# Altium project UltraZOhm_CarrierBoard.PrjPcb (part 5 of 8)

## Sheet J2.SchDoc
size A4; PageSetup: Record=PageOptions|CenterHorizontal=True|CenterVertical=True|PrintScale=1.00|XCorrection=1.00|YCorrection=1.00|PrintKind=0|BorderSize=5000000|LeftOffset=0|BottomOffset=0|Orientation=2|PaperLength=1000|PaperWidth=1000|Scale=100|PaperSource=7|PrintQuality=-3|MediaType=1|DitherType=10|PrintScaleMode=1|PaperKind=A4|PaperIndex=9; Author: A. Geiger & E. Liegmann; CompanyName: Technische Hochschule Nürnberg Georg Simon Ohm; Organization: UltraZohm; Address1: Kesslerplatz 12; Address2: 90489 Nürnberg; Address3: GERMANY; SheetNumber: 4; SheetTotal: 36; Website: www.ultrazohm.com
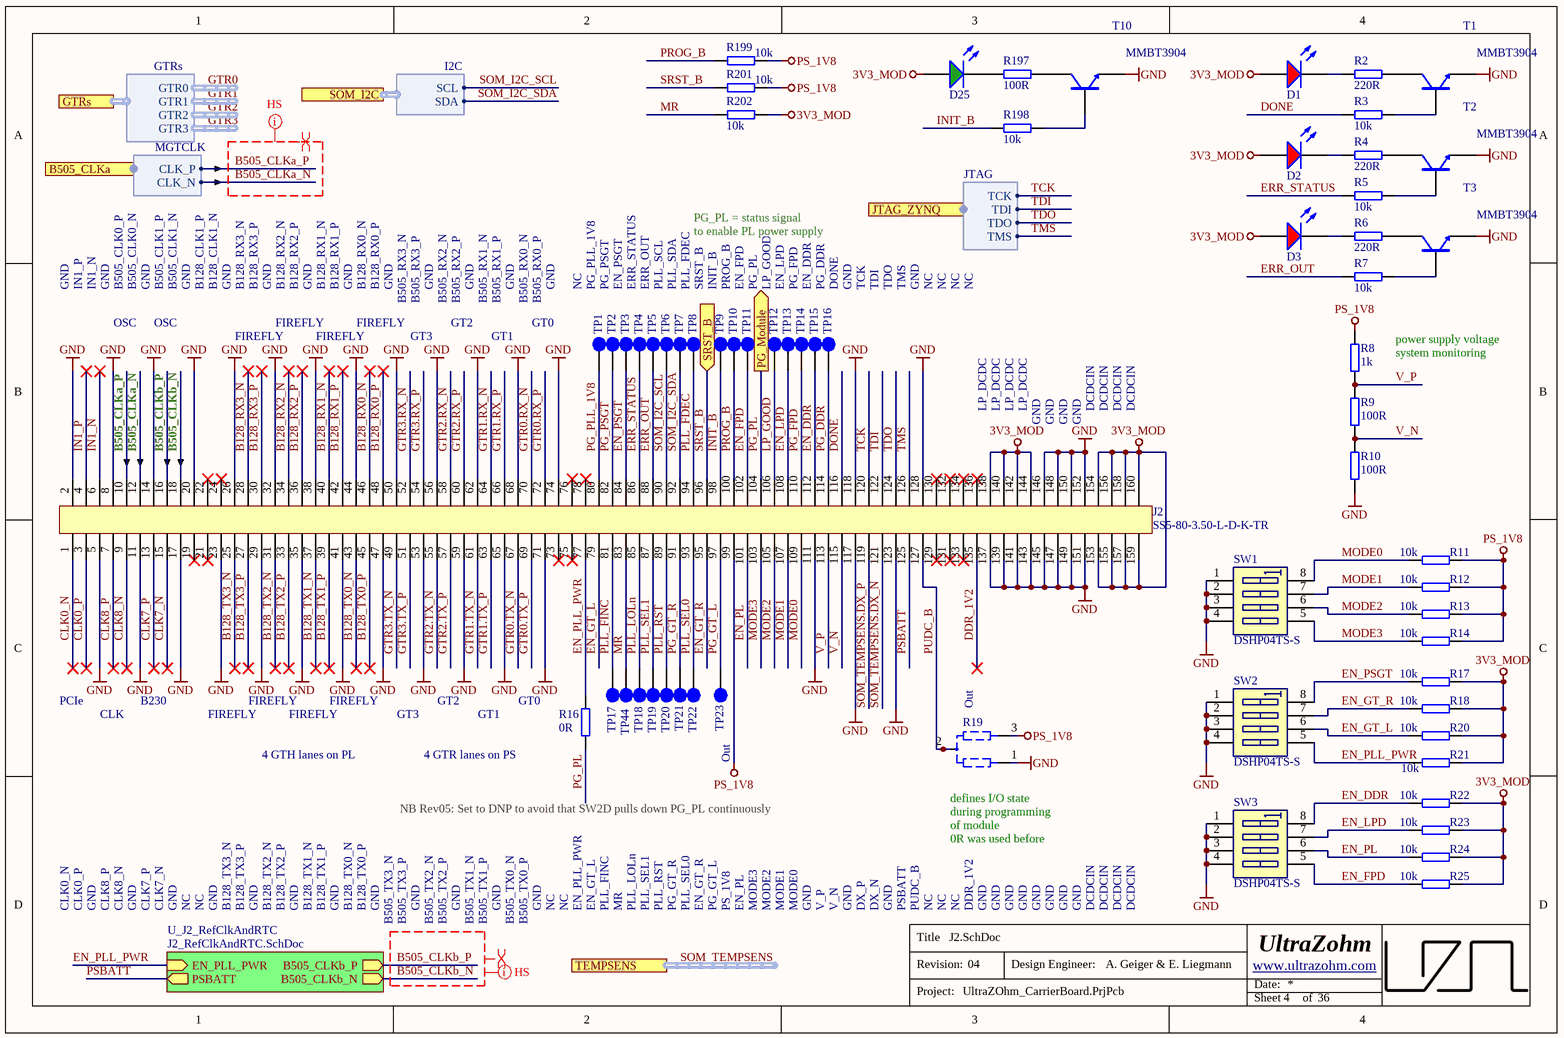
[diagram p13: J2.SchDoc]

### Parts
D1  LED Red  [WL-SMCW_0603]  (value not drawn)
D2  LED Red  [WL-SMCW_0603]  (value not drawn)
D3  LED Red  [WL-SMCW_0603]  (value not drawn)
D25  LED Green  [WL-SMCW_0603]  (value not drawn)
J2  SS5-80-3.50-L-D-K-TR  [SS5-80-3.50-L-D-K-TR]
R2  220R  [R_0603_TE]
R3  10k  [R_0603_TE]
R4  220R  [R_0603_TE]
R5  10k  [R_0603_TE]
R6  220R  [R_0603_TE]
R7  10k  [R_0603_TE]
R8  1k  [R_0603_TE]
R9  100R  [R_0603_TE]
R10  100R  [R_0603_TE]
R11  10k  [R_0603_TE]
R12  10k  [R_0603_TE]
R13  10k  [R_0603_TE]
R14  10k  [R_0603_TE]
R16  0R  [R_0603_TE]
R17  10k  [R_0603_TE]
R18  10k  [R_0603_TE]
R19  Manual Assembly 1608 (0603)  [TP_DUAL_RES_0603]  (value not drawn)  (no BOM)
R20  10k  [R_0603_TE]
R21  10k  [R_0603_TE]
R22  10k  [R_0603_TE]
R23  10k  [R_0603_TE]
R24  10k  [R_0603_TE]
R25  10k  [R_0603_TE]
R197  100R  [R_0603_TE]
R198  10k  [R_0603_TE]
R199  10k  [R_0603_TE]
R201  10k  [R_0603_TE]
R202  10k  [R_0603_TE]
SW1  DSHP04TS-S  [416131160804]
SW2  DSHP04TS-S  [416131160804]
SW3  DSHP04TS-S  [416131160804]
T1  MMBT3904  [SOT95P280X145-3N]
T2  MMBT3904  [SOT95P280X145-3N]
T3  MMBT3904  [SOT95P280X145-3N]
T10  MMBT3904  [SOT95P280X145-3N]
TP1  Testpoint 1mm  [TP_1mm]  (value not drawn)  (no BOM)
TP2  Testpoint 1mm  [TP_1mm]  (value not drawn)  (no BOM)
TP3  Testpoint 1mm  [TP_1mm]  (value not drawn)  (no BOM)
TP4  Testpoint 1mm  [TP_1mm]  (value not drawn)  (no BOM)
TP5  Testpoint 1mm  [TP_1mm]  (value not drawn)  (no BOM)
TP6  Testpoint 1mm  [TP_1mm]  (value not drawn)  (no BOM)
TP7  Testpoint 1mm  [TP_1mm]  (value not drawn)  (no BOM)
TP8  Testpoint 1mm  [TP_1mm]  (value not drawn)  (no BOM)
TP9  Testpoint 1mm  [TP_1mm]  (value not drawn)  (no BOM)
TP10  Testpoint 1mm  [TP_1mm]  (value not drawn)  (no BOM)
TP11  Testpoint 1mm  [TP_1mm]  (value not drawn)  (no BOM)
TP12  Testpoint 1mm  [TP_1mm]  (value not drawn)  (no BOM)
TP13  Testpoint 1mm  [TP_1mm]  (value not drawn)  (no BOM)
TP14  Testpoint 1mm  [TP_1mm]  (value not drawn)  (no BOM)
TP15  Testpoint 1mm  [TP_1mm]  (value not drawn)  (no BOM)
TP16  Testpoint 1mm  [TP_1mm]  (value not drawn)  (no BOM)
TP17  Testpoint 1mm  [TP_1mm]  (value not drawn)  (no BOM)
TP18  Testpoint 1mm  [TP_1mm]  (value not drawn)  (no BOM)
TP19  Testpoint 1mm  [TP_1mm]  (value not drawn)  (no BOM)
TP20  Testpoint 1mm  [TP_1mm]  (value not drawn)  (no BOM)
TP21  Testpoint 1mm  [TP_1mm]  (value not drawn)  (no BOM)
TP22  Testpoint 1mm  [TP_1mm]  (value not drawn)  (no BOM)
TP23  Testpoint 1mm  [TP_1mm]  (value not drawn)  (no BOM)
TP44  Testpoint 1mm  [TP_1mm]  (value not drawn)  (no BOM)

### Sub-sheets
U_J2_RefClkAndRTC = J2_RefClkAndRTC.SchDoc (file not in this document): EN_PLL_PWR (in), B505_CLKb_P (out), B505_CLKb_N (out), PSBATT (out)

### Ports
B505_CLKa (harness MGTCLK), GTRs (harness GTRs), JTAG_ZYNQ (harness JTAG), PG_Module (out), SOM_I2C (harness I2C), SRST_B (in), TEMPSENS (harness T_DIODE)

### Harnesses
JTAG: TDI, TCK, TMS, TDO
I2C: SCL, SDA
GTRs: GTR0, GTR1, GTR2, GTR3
MGTCLK: CLK_N, CLK_P

### Nets
3V3_MOD: D1.2(A) D2.2(A) D3.2(A) D25.2(A) J2.138 J2.140 J2.142 J2.144 J2.153 J2.154 J2.155 J2.156 J2.157 J2.158 J2.159 J2.160 R17.2 R18.2 R20.2 R21.2 R22.2 R23.2 R24.2 R25.2 R202.2
GND: J2.2 J2.5 J2.8 J2.11 J2.14 J2.17 J2.20 J2.23 J2.26 J2.29 J2.32 J2.35 J2.38 J2.41 J2.44 J2.47 J2.50 J2.53 J2.56 J2.59 J2.62 J2.65 J2.68 J2.71 J2.74 J2.111 J2.117 J2.118 J2.123 J2.128 J2.137 J2.139 J2.141 J2.143 J2.145 J2.146 J2.147 J2.148 J2.149 J2.150 J2.151 J2.152 R10.1 R19.1 SW1.1 SW1.2 SW1.3 SW1.4 SW2.1 SW2.2 SW2.3 SW2.4 SW3.1 SW3.2 SW3.3 SW3.4 T1.2(EMITTER) T2.2(EMITTER) T3.2(EMITTER) T10.2(EMITTER)
PS_1V8: J2.99 R8.2 R11.2 R12.2 R13.2 R14.2 R19.3 R199.2 R201.2
B128_RX0_N: J2.46
B128_RX0_P: J2.48
B128_RX1_N: J2.40
B128_RX1_P: J2.42
B128_RX2_N: J2.34
B128_RX2_P: J2.36
B128_RX3_N: J2.28
B128_RX3_P: J2.30
B128_TX0_N: J2.43
B128_TX0_P: J2.45
B128_TX1_N: J2.37
B128_TX1_P: J2.39
B128_TX2_N: J2.31
B128_TX2_P: J2.33
B128_TX3_N: J2.25
B128_TX3_P: J2.27
B505_CLKa_N: J2.12 ; port B505_CLKa.CLK_N
B505_CLKa_P: J2.10 ; port B505_CLKa.CLK_P
B505_CLKb_N: J2.18 ; sheet U_J2_RefClkAndRTC/B505_CLKb_N
B505_CLKb_P: J2.16 ; sheet U_J2_RefClkAndRTC/B505_CLKb_P
CLK0_N: J2.1
CLK0_P: J2.3
CLK7_N: J2.15
CLK7_P: J2.13
CLK8_N: J2.9
CLK8_P: J2.7
DDR_1V2: J2.135
DONE: J2.116 R3.1
EN_DDR: J2.112 R22.1 SW3.8 TP15.1
EN_FPD: J2.102 R25.1 SW3.5 TP11.1
EN_GT_L: J2.79 R20.1 SW2.6
EN_GT_R: J2.95 R18.1 SW2.7
EN_LPD: J2.108 R23.1 SW3.7 TP13.1
EN_PL: J2.101 R24.1 SW3.6
EN_PLL_PWR: J2.77 R16.2 R21.1 SW2.5 ; sheet U_J2_RefClkAndRTC/EN_PLL_PWR
EN_PSGT: J2.84 R17.1 SW2.8 TP3.1
ERR_OUT: J2.88 R7.1 TP5.1
ERR_STATUS: J2.86 R5.1 TP4.1
GTR0.RX_N: J2.70
GTR0.RX_P: J2.72
GTR0.TX_N: J2.67
GTR0.TX_P: J2.69
GTR1.RX_N: J2.64
GTR1.RX_P: J2.66
GTR1.TX_N: J2.61
GTR1.TX_P: J2.63
GTR2.RX_N: J2.58
GTR2.RX_P: J2.60
GTR2.TX_N: J2.55
GTR2.TX_P: J2.57
GTR3.RX_N: J2.52
GTR3.RX_P: J2.54
GTR3.TX_N: J2.49
GTR3.TX_P: J2.51
IN1_N: J2.6
IN1_P: J2.4
INIT_B: J2.98 R198.1 TP9.1
LP_GOOD: J2.106 TP12.1
MODE0: J2.109 R11.1 SW1.8
MODE1: J2.107 R12.1 SW1.7
MODE2: J2.105 R13.1 SW1.6
MODE3: J2.103 R14.1 SW1.5
MR: J2.83 R202.1 TP44.1
PG_DDR: J2.114 TP16.1
PG_FPD: J2.110 TP14.1
PG_GT_L: J2.97 TP23.1
PG_GT_R: J2.91 TP21.1
PG_PL: J2.104 R16.1 ; port PG_Module
PG_PLL_1V8: J2.80 TP1.1
PG_PSGT: J2.82 TP2.1
PLL_FDEC: J2.94 TP8.1
PLL_FINC: J2.81 TP17.1
PLL_LOLn: J2.85 TP18.1
PLL_RST: J2.89 TP20.1
PLL_SEL0: J2.93 TP22.1
PLL_SEL1: J2.87 TP19.1
PROG_B: J2.100 R199.1 TP10.1
PSBATT: J2.125 ; sheet U_J2_RefClkAndRTC/PSBATT
PUDC_B: J2.127 R19.2
SOM_I2C_SCL: J2.90 TP6.1 ; port SOM_I2C.SCL
SOM_I2C_SDA: J2.92 TP7.1 ; port SOM_I2C.SDA
SOM_TEMPSENS.DX_N: J2.121
SOM_TEMPSENS.DX_P: J2.119
SRST_B: J2.96 R201.1 ; port SRST_B
TCK: J2.120 ; port JTAG_ZYNQ.TCK
TDI: J2.122 ; port JTAG_ZYNQ.TDI
TDO: J2.124 ; port JTAG_ZYNQ.TDO
TMS: J2.126 ; port JTAG_ZYNQ.TMS
V_N: J2.115 R9.1 R10.2
V_P: J2.113 R8.1 R9.2
NetD1_1: D1.1(K) R2.1
NetD2_1: D2.1(K) R4.1
NetD3_1: D3.1(K) R6.1
NetD25_1: D25.1(K) R197.2
NetR2_2: R2.2 T1.3(COLLECTOR)
NetR3_2: R3.2 T1.1(BASIS)
NetR4_2: R4.2 T2.3(COLLECTOR)
NetR5_2: R5.2 T2.1(BASIS)
NetR6_2: R6.2 T3.3(COLLECTOR)
NetR7_2: R7.2 T3.1(BASIS)
NetR197_1: R197.1 T10.3(COLLECTOR)
NetR198_2: R198.2 T10.1(BASIS)

Not connected (* = marked no-connect by the designer): J2 19* 21* 22* 24* 73* 75* 76* 78* 129* 130* 131* 132* 133* 134* 136*

### Buses and harness runs
harness SOM_TEMPSENS = port TEMPSENS

### Layout directives
differential pair: B505_CLKa_N, B505_CLKa_P, B505_CLKb_N, B505_CLKb_P
net class HS: B505_CLKa_N, B505_CLKa_P, B505_CLKb_N, B505_CLKb_P

### Notes on the sheet
- PG_PL = status signal
  to enable PL power supply
- GND
- IN1_P
- IN1_N
- B505_CLK0_P
- B505_CLK0_N
- B505_CLK1_P
- B505_CLK1_N
- B128_CLK1_P
- B128_CLK1_N
- B128_RX3_N
- B128_RX3_P
- B128_RX2_N
- B128_RX2_P
- B128_RX1_N
- B128_RX1_P
- B128_RX0_N
- B128_RX0_P
- B505_RX3_N
- B505_RX3_P
- B505_RX2_N
- B505_RX2_P
- B505_RX1_N
- B505_RX1_P
- B505_RX0_N
- B505_RX0_P
- NC
- PG_PLL_1V8
- PG_PSGT
- EN_PSGT
- ERR_STATUS
- ERR_OUT
- PLL_SCL
- PLL_SDA
- PLL_FDEC
- SRST_B
- INIT_B
- PROG_B
- EN_FPD
- PG_PL
- LP_GOOD
- EN_LPD
- PG_FPD
- EN_DDR
- PG_DDR
- DONE
- TCK
- TDI
- TDO
- TMS
- OSC
- FIREFLY
- GT3
- GT2
- GT1
- GT0
- power supply voltage system monitoring
- LP_DCDC
- DCDCIN
- PCIe
- CLK
- B230
- (near R19) Out
- 4 GTH lanes on PL
- 4 GTR lanes on PS
- Out
- NB Rev05: Set to DNP to avoid that SW2D pulls down PG_PL continuously
- (near R19) defines I/O state during programming of module
  0R was used before
- CLK0_N
- CLK0_P
- CLK8_P
- CLK8_N
- CLK7_P
- CLK7_N
- B128_TX3_N
- B128_TX3_P
- B128_TX2_N
- B128_TX2_P
- B128_TX1_N
- B128_TX1_P
- B128_TX0_N
- B128_TX0_P
- B505_TX3_N
- B505_TX3_P
- B505_TX2_N
- B505_TX2_P
- B505_TX1_N
- B505_TX1_P
- B505_TX0_N
- B505_TX0_P
- EN_PLL_PWR
- EN_GT_L
- PLL_FINC
- MR
- PLL_LOLn
- PLL_SEL1
- PLL_RST
- PG_GT_R
- PLL_SEL0
- EN_GT_R
- PG_GT_L
- PS_1V8
- EN_PL
- MODE3
- MODE2
- MODE1
- MODE0
- V_P
- V_N
- DX_P
- DX_N
- PSBATT
- PUDC_B
- DDR_1V2
- Title
- Revision:
- Design Engineer:
- Date:
- Project:
- Sheet
- of

### Library data of the parts
D1-D3 = UZgen_LED_0603_Red: Standard LEDs - SMD 0603 red; Manufacturer: UZgen; Created from: UZgenTool; Manufacturer Part Number: UZgen_LED_0603_Red; PartID: 22; Created On: 09/09/2024 10:45:01; ComponentLink1Description: N/A; ComponentLink1URL: N/A; Component Type: LED Diode; Device Package: 0603; Last Updated: 09/09/2024 10:45:01; Mounting Type: SMD; Supplier 1: LCSC; Supplier Part Number 1: =LCSC Part Number; Type: Standard; Value: LED Red; Live Cycle Status: 1; Stock number: not stored; Color: red
D25 = UZgen_LED_0603_Green: Standard LEDs - SMD 0603 green; Manufacturer: UZgen; Created from: UZgenTool; Manufacturer Part Number: UZgen_LED_0603_Green; PartID: 21; Created On: 09/09/2024 10:45:01; ComponentLink1Description: N/A; ComponentLink1URL: N/A; Component Type: LED Diode; Device Package: 0603; Last Updated: 09/09/2024 10:45:01; Mounting Type: SMD; Supplier 1: LCSC; Supplier Part Number 1: =LCSC Part Number; Type: Standard; Value: LED Green; Live Cycle Status: 1; Stock number: not stored; Color: green
J2 = SS5-80-3.50-L-D-K-TR: 0.5 mm Ultra Fine Pitch Socket REF192552-01, 160 Pins; Manufacturer: SAMTEC; Created from: MGremer; Number of positions: 80; Manufacturer Part Number: SS5-80-3.50-L-D-K-TR; PartID: 27; Created On: 01/12/2020 18:14:32; ComponentLink1Description: Homepage; ComponentLink1URL: https://www.samtec.com/de/products/ss5-80-3.50-l-d-k-tr; Component Type: Samtec Connector; Device Package: Connector; Last Updated: 11/07/2024 09:43:54; Mounting Type: SMD; Supplier 1: SAMTEC; Supplier Part Number 1: SS5-80-3.50-L-D-K-TR; Type: Connector; Live Cycle Status: 1; Number of rows: 2; LCSC Part Number: C5292077; Stock number: not stored
R2 R4 R6 = UZgen_R_0603_220R: Generic resistor; Manufacturer: UZgen; Tolerance: 1 %; Created from: UZgenTool; Value: 220R; Manufacturer Part Number: UZgen_R_0603_220R; PartID: 205; Created On: 02/07/2024 17:29:49; Device Package: 0603; Mounting Type: SMD; Last Updated: 02/07/2024 17:29:49
R3 R5 R7 R11-R14 R17 R18 R20-R25 R198 R199 R201 R202 = UZgen_R_0603_10k: Generic resistor; Manufacturer: UZgen; Tolerance: 1 %; Created from: AGeiger; Value: 10k; Manufacturer Part Number: UZgen_R_0603_10k; PartID: 1; Created On: 02/07/2024 14:34:53; Device Package: 0603; Mounting Type: SMD; Last Updated: 02/07/2024 14:37:16
R8 = UZgen_R_0603_1k: Generic resistor; Manufacturer: UZgen; Tolerance: 1 %; Created from: UZgenTool; Value: 1k; Manufacturer Part Number: UZgen_R_0603_1k; PartID: 221; Created On: 02/07/2024 17:29:49; Device Package: 0603; Mounting Type: SMD; Last Updated: 02/07/2024 17:29:49
R9 R10 R197 = UZgen_R_0603_100R: Generic resistor; Manufacturer: UZgen; Tolerance: 1 %; Created from: UZgenTool; Value: 100R; Manufacturer Part Number: UZgen_R_0603_100R; PartID: 197; Created On: 02/07/2024 17:29:48; Device Package: 0603; Mounting Type: SMD; Last Updated: 02/07/2024 17:29:48
R16 = UZgen_R_0603_0R: Generic resistor; Manufacturer: UZgen; Tolerance: 1 %; Created from: UZgenTool; Value: 0R; Manufacturer Part Number: UZgen_R_0603_0R; PartID: 581; Created On: 08/07/2024 14:34:30; Device Package: 0603; Mounting Type: SMD; Last Updated: 08/07/2024 14:34:30
R19 = 30792: Manual Assembly Resistors Placeholder 1608 (0603) Dual; AN: 30792; Mixed: MECH
SW1-SW3 = DSHP04TS-S: 04p, 1.27mm Pitch, Horizontal, HP Type, SMT, flat Actuator, black, with Tape, T&R; Manufacturer: XKB Connectivity; Value: DIP-Switch; Created from: T. Wendt; Manufacturer Part Number: DSHP04TS-S; PartID: 6; Created On: 02/03/2021 14:59:37; ComponentLink1Description: Datasheet; ComponentLink1URL: https://datasheet.lcsc.com/szlcsc/1912111437_XKB-Connectivity-DSHP04TS-S_C319050.pdf; Component Type: DIP-Switch; Device Package: DIP; Last Updated: 08/10/2021 08:00:32; Minimum Order: 1; Mounting Type: SMD; Supplier 1: LCSC; Supplier Part Number 1: C319050; Type: DIP-Switch; Live Cycle Status: 1; LCSC Part Number: C319050; Stock number: not stored
T1-T3 T10 = MMBT3904: Bipolartransistor, 40V 200mW 200mA 100@10mA,1V 300MHz 300mV@50mA,5mA NPN +150℃@(Tj) SOT-23(SOT-23-3); Manufacturer: Jiangsu Changjing Electronics Technology Co., Ltd.; Number Of Channels: single; Collector Basis Voltage: 60 V; Created from: NDiringer; Manufacturer Part Number: MMBT3904; PartID: 2; Created On: 10/06/2022 12:04:49; ComponentLink1Description: Datasheet; ComponentLink1URL: https://datasheet.lcsc.com/lcsc/1811011934_Jiangsu-Changjing-Electronics-Technology-Co---Ltd--MMBT3904_C20526.pdf; Component Type: Bipolartransistor; Device Package: SOT-23-3; Last Updated: 10/08/2022 13:48:16; Mounting Type: SMD; Operating Temperature: -55 - 150 °C; Series: MMBT3904; Supplier 1: Mouser; Supplier Part Number 1: MMBT3904; Supplier 2: LCSC/JLCPCB; Supplier Part Number 2: C20526; Type: Bipolartransistor; Collector Emitter Voltage: 40 V; Polarization: NPN; Power Dissipation: 200 mW; Value: 40 V; Live Cycle Status: 1; LCSC Part Number: C20526
TP1-TP23 TP44 = 25063: AN: 25063; Mixed: SMT

## Sheet J3.SchDoc
size A4; Author: A. Geiger & E. Liegmann; CompanyName: Technische Hochschule Nürnberg Georg Simon Ohm; Organization: UltraZohm; Address1: Kesslerplatz 12; Address2: 90489 Nürnberg; Address3: GERMANY; SheetNumber: 5; SheetTotal: 36; Website: www.ultrazohm.com
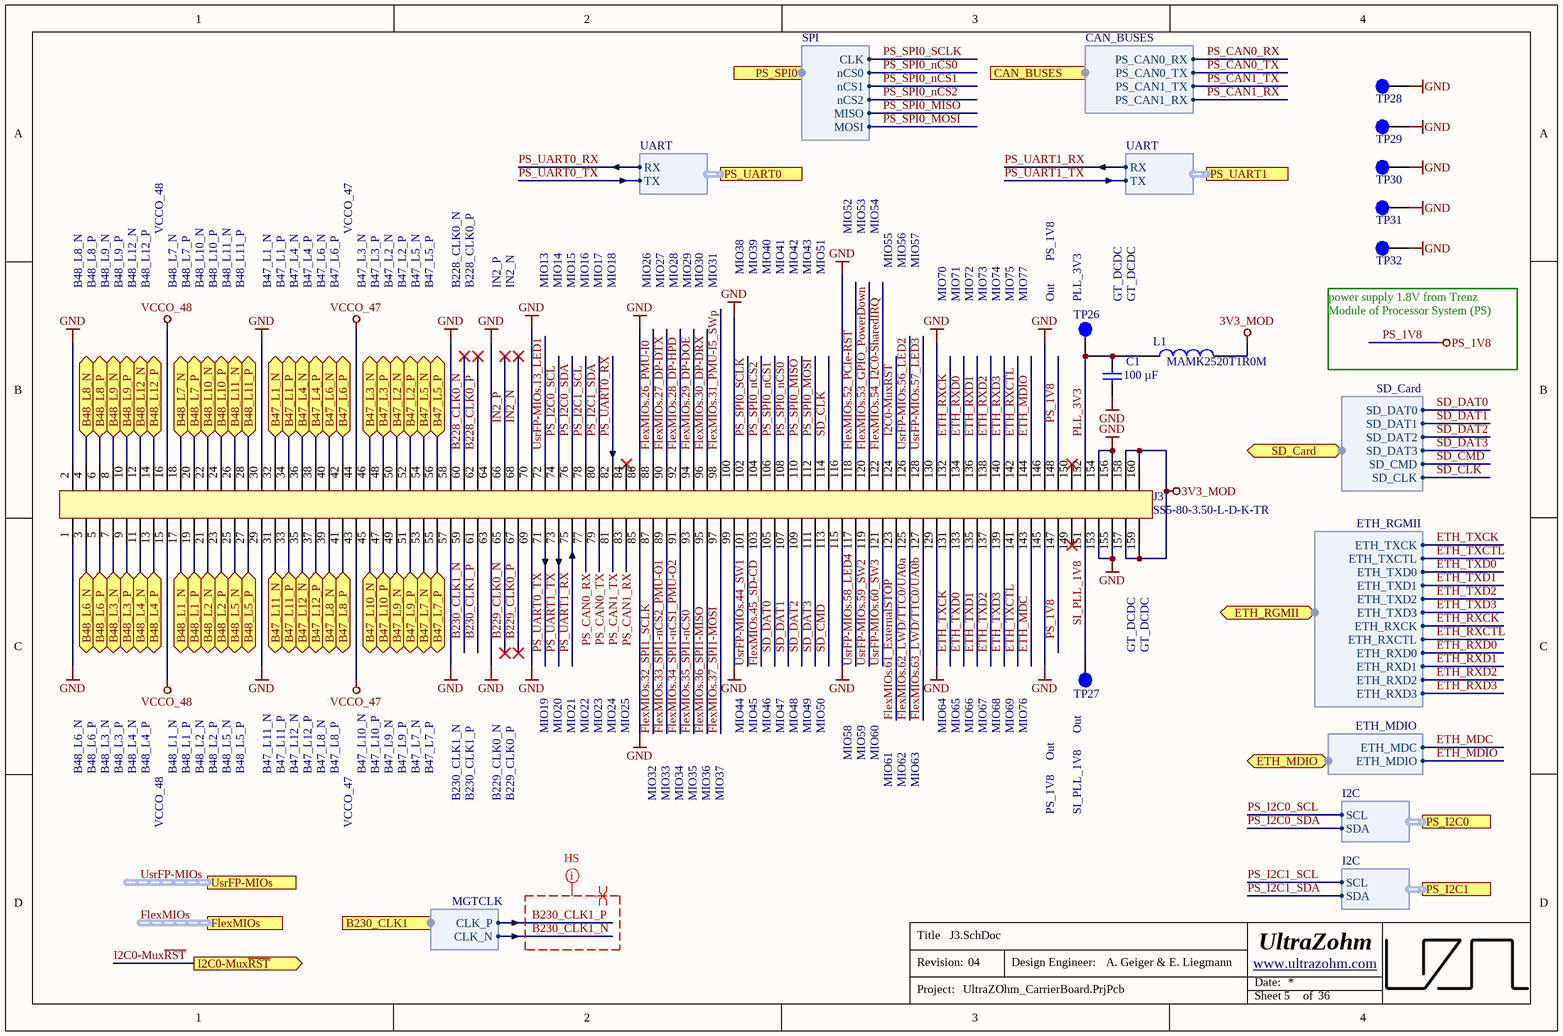
[diagram p14: J3.SchDoc]

### Parts
C1  100 µF  [C_1206_TE]
J3  SS5-80-3.50-L-D-K-TR  [SS5-80-3.50-L-D-K-TR]
L1  MAMK2520T1R0M  [INDC2520X120N]
TP26  Testpoint 1mm  [TP_1mm]  (value not drawn)  (no BOM)
TP27  Testpoint 1mm  [TP_1mm]  (value not drawn)  (no BOM)
TP28  Testpoint 1mm  [TP_1mm]  (value not drawn)  (no BOM)
TP29  Testpoint 1mm  [TP_1mm]  (value not drawn)  (no BOM)
TP30  Testpoint 1mm  [TP_1mm]  (value not drawn)  (no BOM)
TP31  Testpoint 1mm  [TP_1mm]  (value not drawn)  (no BOM)
TP32  Testpoint 1mm  [TP_1mm]  (value not drawn)  (no BOM)

### Ports
B47_L1_N (bidir), B47_L1_P (bidir), B47_L2_N (bidir), B47_L2_P (bidir), B47_L3_N (bidir), B47_L3_P (bidir), B47_L4_N (bidir), B47_L4_P (bidir), B47_L5_N (bidir), B47_L5_P (bidir), B47_L6_N (bidir), B47_L6_P (bidir), B47_L7_N (bidir), B47_L7_P (bidir), B47_L8_N (bidir), B47_L8_P (bidir), B47_L9_N (bidir), B47_L9_P (bidir), B47_L10_N (bidir), B47_L10_P (bidir), B47_L11_N (bidir), B47_L11_P (bidir), B47_L12_N (bidir), B47_L12_P (bidir), B48_L1_N (bidir), B48_L1_P (bidir), B48_L2_N (bidir), B48_L2_P (bidir), B48_L3_N (bidir), B48_L3_P (bidir), B48_L4_N (bidir), B48_L4_P (bidir), B48_L5_N (bidir), B48_L5_P (bidir), B48_L6_N (bidir), B48_L6_P (bidir), B48_L7_N (bidir), B48_L7_P (bidir), B48_L8_N (bidir), B48_L8_P (bidir), B48_L9_N (bidir), B48_L9_P (bidir), B48_L10_N (bidir), B48_L10_P (bidir), B48_L11_N (bidir), B48_L11_P (bidir), B48_L12_N (bidir), B48_L12_P (bidir), B230_CLK1 (harness MGTCLK), CAN_BUSES (harness CAN_BUSES), ETH_MDIO (bidir, harness ETH_MDIO), ETH_RGMII (bidir, harness ETH_RGMII), FlexMIOs (harness FlexMIOs), I2C0-Mux~{RST} (out), PS_I2C0 (harness I2C), PS_I2C1 (harness I2C), PS_SPI0 (harness SPI), PS_UART0 (harness UART), PS_UART1 (harness UART), SD_Card (bidir, harness SD_Card), UsrFP-MIOs (harness UsrFP-MIOs)

### Harnesses
ETH_RGMII: ETH_TXCK, ETH_TXCTL, ETH_TXD0, ETH_TXD1, ETH_TXD2, ETH_TXD3, ETH_RXCK, ETH_RXCTL, ETH_RXD0, ETH_RXD1, ETH_RXD2, ETH_RXD3
SD_Card: SD_DAT0, SD_DAT1, SD_DAT2, SD_DAT3, SD_CMD, SD_CLK
ETH_MDIO: ETH_MDC, ETH_MDIO
SPI: CLK, nCS0, MISO, MOSI, nCS1, nCS2
CAN_BUSES: PS_CAN0_RX, PS_CAN1_RX, PS_CAN1_TX, PS_CAN0_TX
I2C: SCL, SDA
UART: RX, TX
MGTCLK: CLK_N, CLK_P

### Nets
3V3_MOD: J3.157 J3.158 J3.159 J3.160 L1.2
GND: C1.2 J3.1 J3.2 J3.29 J3.30 J3.57 J3.58 J3.63 J3.64 J3.69 J3.70 J3.85 J3.86 J3.99 J3.100 J3.115 J3.116 J3.129 J3.130 J3.145 J3.146 J3.153 J3.154 J3.155 J3.156 TP28.1 TP29.1 TP30.1 TP31.1 TP32.1
PS_1V8: J3.147 J3.148
VCCO_47: J3.43 J3.44
VCCO_48: J3.15 J3.16
B228_CLK0_N: J3.60
B228_CLK0_P: J3.62
B229_CLK0_N: J3.65
B229_CLK0_P: J3.67
B230_CLK1_N: J3.59 ; port B230_CLK1.CLK_N
B230_CLK1_P: J3.61 ; port B230_CLK1.CLK_P
DIG_00_Ch4: J3.32 ; port B47_L1_N
DIG_01_Ch4: J3.31 ; port B47_L11_N
DIG_02_Ch4: J3.28 ; port B48_L11_P
DIG_03_Ch4: J3.27 ; port B48_L5_P
DIG_04_Ch4: J3.26 ; port B48_L11_N
DIG_05_Ch4: J3.25 ; port B48_L5_N
DIG_06_Ch4: J3.24 ; port B48_L10_P
DIG_07_Ch4: J3.23 ; port B48_L2_P
DIG_08_Ch4: J3.22 ; port B48_L10_N
DIG_08_Ch5: J3.56 ; port B47_L5_P
DIG_09_Ch4: J3.21 ; port B48_L2_N
DIG_09_Ch5: J3.55 ; port B47_L7_P
DIG_10_Ch4: J3.20 ; port B48_L7_P
DIG_10_Ch5: J3.54 ; port B47_L5_N
DIG_11_Ch4: J3.19 ; port B48_L1_P
DIG_11_Ch5: J3.53 ; port B47_L7_N
DIG_12_Ch4: J3.18 ; port B48_L7_N
DIG_12_Ch5: J3.52 ; port B47_L2_P
DIG_13_Ch4: J3.17 ; port B48_L1_N
DIG_13_Ch5: J3.51 ; port B47_L9_P
DIG_14_Ch4: J3.14 ; port B48_L12_P
DIG_14_Ch5: J3.50 ; port B47_L2_N
DIG_15_Ch4: J3.13 ; port B48_L4_P
DIG_15_Ch5: J3.49 ; port B47_L9_N
DIG_16_Ch4: J3.12 ; port B48_L12_N
DIG_16_Ch5: J3.48 ; port B47_L3_P
DIG_17_Ch4: J3.11 ; port B48_L4_N
DIG_17_Ch5: J3.47 ; port B47_L10_P
DIG_18_Ch4: J3.10 ; port B48_L9_P
DIG_18_Ch5: J3.46 ; port B47_L3_N
DIG_19_Ch4: J3.9 ; port B48_L3_P
DIG_19_Ch5: J3.45 ; port B47_L10_N
DIG_20_Ch4: J3.8 ; port B48_L9_N
DIG_20_Ch5: J3.42 ; port B47_L6_P
DIG_21_Ch4: J3.7 ; port B48_L3_N
DIG_21_Ch5: J3.41 ; port B47_L8_P
DIG_22_Ch4: J3.6 ; port B48_L8_P
DIG_22_Ch5: J3.40 ; port B47_L6_N
DIG_23_Ch4: J3.5 ; port B48_L6_P
DIG_23_Ch5: J3.39 ; port B47_L8_N
DIG_24_Ch3: J3.4 ; port B48_L8_N
DIG_24_Ch4: J3.38 ; port B47_L4_P
DIG_25_Ch3: J3.3 ; port B48_L6_N
DIG_25_Ch4: J3.37 ; port B47_L12_P
DIG_26_Ch4: J3.36 ; port B47_L4_N
DIG_27_Ch4: J3.35 ; port B47_L12_N
DIG_28_Ch4: J3.34 ; port B47_L1_P
DIG_29_Ch4: J3.33 ; port B47_L11_P
ETH_MDC: J3.143 ; port ETH_MDIO.ETH_MDC
ETH_MDIO: J3.144 ; port ETH_MDIO.ETH_MDIO
ETH_RXCK: J3.132 ; port ETH_RGMII.ETH_RXCK
ETH_RXCTL: J3.142 ; port ETH_RGMII.ETH_RXCTL
ETH_RXD0: J3.134 ; port ETH_RGMII.ETH_RXD0
ETH_RXD1: J3.136 ; port ETH_RGMII.ETH_RXD1
ETH_RXD2: J3.138 ; port ETH_RGMII.ETH_RXD2
ETH_RXD3: J3.140 ; port ETH_RGMII.ETH_RXD3
ETH_TXCK: J3.131 ; port ETH_RGMII.ETH_TXCK
ETH_TXCTL: J3.141 ; port ETH_RGMII.ETH_TXCTL
ETH_TXD0: J3.133 ; port ETH_RGMII.ETH_TXD0
ETH_TXD1: J3.135 ; port ETH_RGMII.ETH_TXD1
ETH_TXD2: J3.137 ; port ETH_RGMII.ETH_TXD2
ETH_TXD3: J3.139 ; port ETH_RGMII.ETH_TXD3
FlexMIOs.26_PMU-I0: J3.88
FlexMIOs.27_DP-DTX: J3.90
FlexMIOs.28_DP-HPD: J3.92
FlexMIOs.29_DP-DOE: J3.94
FlexMIOs.30_DP-DRX: J3.96
FlexMIOs.31_PMU-I5_SWp: J3.98
FlexMIOs.32_SPI1_SCLK: J3.87
FlexMIOs.33_SPI1-nCS2_PMU-O1: J3.89
FlexMIOs.34_SPI1-nCS1_PMU-O2: J3.91
FlexMIOs.35_SPI1-nCS0: J3.93
FlexMIOs.36_SPI1-MISO: J3.95
FlexMIOs.37_SPI1-MOSI: J3.97
FlexMIOs.45_SD-CD: J3.103
FlexMIOs.52_PCIe-~{RST}: J3.118
FlexMIOs.53_GPIO_PowerDown: J3.120
FlexMIOs.54_I2C0-Shared~{IRQ}: J3.122
FlexMIOs.61_ExternalSTOP: J3.123
FlexMIOs.62_LWD/TTC0/UA0a: J3.125
FlexMIOs.63_LWD/TTC0/UA0b: J3.127
I2C0-Mux~{RST}: J3.124 ; port I2C0-Mux~{RST}
IN2_N: J3.68
IN2_P: J3.66
PLL_3V3: C1.1 J3.152 L1.1 TP26.1
PS_CAN0_RX: J3.77 ; port CAN_BUSES.PS_CAN0_RX
PS_CAN0_TX: J3.79 ; port CAN_BUSES.PS_CAN0_TX
PS_CAN1_RX: J3.83 ; port CAN_BUSES.PS_CAN1_RX
PS_CAN1_TX: J3.81 ; port CAN_BUSES.PS_CAN1_TX
PS_I2C0_SCL: J3.74 ; port PS_I2C0.SCL
PS_I2C0_SDA: J3.76 ; port PS_I2C0.SDA
PS_I2C1_SCL: J3.78 ; port PS_I2C1.SCL
PS_I2C1_SDA: J3.80 ; port PS_I2C1.SDA
PS_SPI0_MISO: J3.110 ; port PS_SPI0.MISO
PS_SPI0_MOSI: J3.112 ; port PS_SPI0.MOSI
PS_SPI0_nCS0: J3.108 ; port PS_SPI0.nCS0
PS_SPI0_nCS1: J3.106 ; port PS_SPI0.nCS1
PS_SPI0_nCS2: J3.104 ; port PS_SPI0.nCS2
PS_SPI0_SCLK: J3.102 ; port PS_SPI0.CLK
PS_UART0_RX: J3.82 ; port PS_UART0.RX
PS_UART0_TX: J3.71 ; port PS_UART0.TX
PS_UART1_RX: J3.75 ; port PS_UART1.RX
PS_UART1_TX: J3.73 ; port PS_UART1.TX
SD_CLK: J3.114 ; port SD_Card.SD_CLK
SD_CMD: J3.113 ; port SD_Card.SD_CMD
SD_DAT0: J3.105 ; port SD_Card.SD_DAT0
SD_DAT1: J3.107 ; port SD_Card.SD_DAT1
SD_DAT2: J3.109 ; port SD_Card.SD_DAT2
SD_DAT3: J3.111 ; port SD_Card.SD_DAT3
SI_PLL_1V8: J3.151 TP27.1
UsrFP-MIOs.13_LED1: J3.72
UsrFP-MIOs.44_SW1: J3.101
UsrFP-MIOs.56_LED2: J3.126
UsrFP-MIOs.57_LED3: J3.128
UsrFP-MIOs.58_LED4: J3.117
UsrFP-MIOs.59_SW2: J3.119
UsrFP-MIOs.60_SW3: J3.121

Not connected (* = marked no-connect by the designer): J3 84* 149* 150*

### Buses and harness runs
harness FlexMIOs = port FlexMIOs
harness UsrFP-MIOs = port UsrFP-MIOs

### Layout directives
differential pair: B230_CLK1_N, B230_CLK1_P
net class HS: B230_CLK1_N, B230_CLK1_P

### Notes on the sheet
- VCCO_48
- VCCO_47
- MIO52
- MIO53
- MIO54
- B48_L8_N
- B48_L8_P
- B48_L9_N
- B48_L9_P
- B48_L12_N
- B48_L12_P
- B48_L7_N
- B48_L7_P
- B48_L10_N
- B48_L10_P
- B48_L11_N
- B48_L11_P
- B47_L1_N
- B47_L1_P
- B47_L4_N
- B47_L4_P
- B47_L6_N
- B47_L6_P
- B47_L3_N
- B47_L3_P
- B47_L2_N
- B47_L2_P
- B47_L5_N
- B47_L5_P
- B228_CLK0_N
- B228_CLK0_P
- IN2_P
- IN2_N
- MIO13
- MIO14
- MIO15
- MIO16
- MIO17
- MIO18
- MIO26
- MIO27
- MIO28
- MIO29
- MIO30
- MIO31
- MIO38
- MIO39
- MIO40
- MIO41
- MIO42
- MIO43
- MIO51
- MIO55
- MIO56
- MIO57
- MIO70
- MIO71
- MIO72
- MIO73
- MIO74
- MIO75
- MIO77
- PS_1V8
- (near TP26) Out
- (near TP26) PLL_3V3
- (near TP26) GT_DCDC
- GT_DCDC
- (near TP32) power supply 1.8V from Trenz Module of Processor System (PS)
- (near TP27) GT_DCDC
- B48_L6_N
- B48_L6_P
- B48_L3_N
- B48_L3_P
- B48_L4_N
- B48_L4_P
- B48_L1_N
- B48_L1_P
- B48_L2_N
- B48_L2_P
- B48_L5_N
- B48_L5_P
- B47_L11_N
- B47_L11_P
- B47_L12_N
- B47_L12_P
- B47_L8_N
- B47_L8_P
- B47_L10_N
- B47_L10_P
- B47_L9_N
- B47_L9_P
- B47_L7_N
- B47_L7_P
- MIO19
- MIO20
- MIO21
- MIO22
- MIO23
- MIO24
- MIO25
- MIO44
- MIO45
- MIO46
- MIO47
- MIO48
- MIO49
- MIO50
- MIO58
- MIO59
- MIO60
- MIO61
- MIO62
- MIO63
- MIO64
- MIO65
- MIO66
- MIO67
- MIO68
- MIO69
- MIO76
- Out
- (near TP27) Out
- B230_CLK1_N
- B230_CLK1_P
- B229_CLK0_N
- B229_CLK0_P
- MIO32
- MIO33
- MIO34
- MIO35
- MIO36
- MIO37
- SI_PLL_1V8
- Title
- Revision:
- Design Engineer:
- Date:
- Project:
- Sheet
- of

### Library data of the parts
C1 = CL31A107MQHNNNE: 6.3V 100uF X5R ±20% 1206 Multilayer Ceramic Capacitors MLCC; Manufacturer: Samsung Electro-Mechanics; Created from: MGeier; Tolerance: 20%; Value: 100 µF; Manufacturer Part Number: CL31A107MQHNNNE; PartID: 152; Created On: 02/08/2024 16:00:00; ComponentLink1Description: Datasheet; ComponentLink1URL: https://wmsc.lcsc.com/wmsc/upload/file/pdf/v2/lcsc/2304140030_Samsung-Electro-Mechanics-CL31A107MQHNNNE_C15008.pdf; Component Type: Capacitor 1206; Device Package: 1206; Last Updated: 02/08/2024 16:00:00; Mounting Type: SMD; Operating Temperature: -55 - 85°C; Series: CL; Supplier 1: LCSC; Supplier Part Number 1: C15008; Type: Capacitor; Voltage Rating: 6.3 V; Live Cycle Status: 1; LCSC Part Number: C15008; Stock number: not stored
J3 = SS5-80-3.50-L-D-K-TR: as J2 on sheet J2; Manufacturer Part Number: SS5-80-3.50-L-D-K-TR; PartID: 27; Created On: 01/12/2020 18:14:32; ComponentLink1Description: Homepage; ComponentLink1URL: https://www.samtec.com/de/products/ss5-80-3.50-l-d-k-tr; Component Type: Samtec Connector; Device Package: Connector; Last Updated: 11/07/2024 09:43:54; Mounting Type: SMD; Supplier 1: SAMTEC; Supplier Part Number 1: SS5-80-3.50-L-D-K-TR; Type: Connector; Live Cycle Status: 1; Number of rows: 2; LCSC Part Number: C5292077; Stock number: not stored
L1 = MAMK2520T1R0M: 1uH @2MHz ±20%, 2.7A, 59mOhm, 5040; Manufacturer: Taiyo Yuden; MF: EPCOS / TDK; DCR: 320m; Rated Current: 0.85 A; Type: Inductance SMD; Created from: FRosner; Value: 1uH; MPN: B82464G4154M; Supplier 1: Mouser; Supplier Part Number 1: 963-MAMK2520T1R0M; Manufacturer Part Number: MAMK2520T1R0M; PartID: 23; Created On: 05/09/2024 10:52:30; ComponentLink1Description: Datasheet; ComponentLink1URL: https://www.mouser.de/datasheet/2/396/wound10_e-1396630.pdf; Component Type: SMD Power Inductor; Device Package: 1008 (2520 metric); Last Updated: 05/09/2024 12:46:26; Mounting Type: SMD; Operating Temperature: -40°C to +105°C; Series: MA; Supplier 2: LCSC; Supplier Part Number 2: C92924; DC current: 2.7 A; Live Cycle Status: 1; LCSC Part Number: C92924; Stock number: not stored
TP26-TP32 = 25063: AN: 25063; Mixed: SMT

## Sheet J4.SchDoc
size A4; Author: A. Geiger & E. Liegmann; CompanyName: Technische Hochschule Nürnberg Georg Simon Ohm; Organization: UltraZohm; Address1: Kesslerplatz 12; Address2: 90489 Nürnberg; Address3: GERMANY; SheetNumber: 6; SheetTotal: 36; Website: www.ultrazohm.com
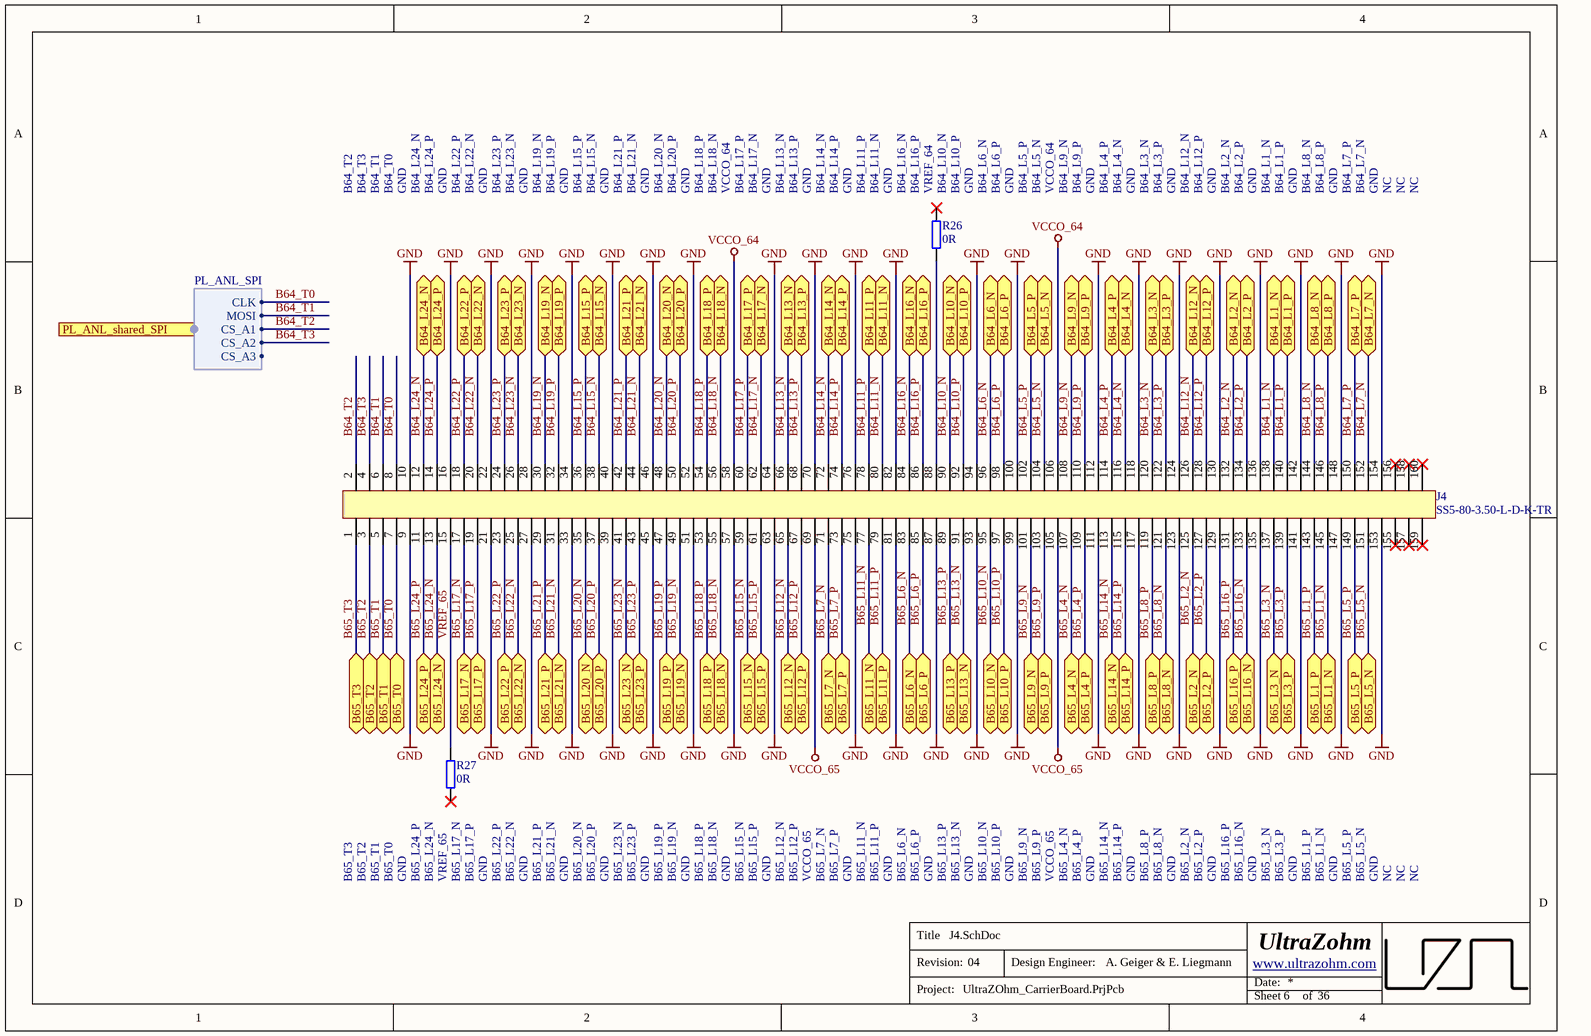
[diagram p15: J4.SchDoc]

### Parts
J4  SS5-80-3.50-L-D-K-TR  [SS5-80-3.50-L-D-K-TR]
R26  0R  [R_0603_TE]
R27  0R  [R_0603_TE]

### Ports
B64_L1_N (bidir), B64_L1_P (bidir), B64_L2_N (bidir), B64_L2_P (bidir), B64_L3_N (bidir), B64_L3_P (bidir), B64_L4_N (bidir), B64_L4_P (bidir), B64_L5_N (bidir), B64_L5_P (bidir), B64_L6_N (bidir), B64_L6_P (bidir), B64_L7_N (bidir), B64_L7_P (bidir), B64_L8_N (bidir), B64_L8_P (bidir), B64_L9_N (bidir), B64_L9_P (bidir), B64_L10_N (bidir), B64_L10_P (bidir), B64_L11_N (bidir), B64_L11_P (bidir), B64_L12_N (bidir), B64_L12_P (bidir), B64_L13_N (bidir), B64_L13_P (bidir), B64_L14_N (bidir), B64_L14_P (bidir), B64_L15_N (bidir), B64_L15_P (bidir), B64_L16_N (bidir), B64_L16_P (bidir), B64_L17_N (bidir), B64_L17_P (bidir), B64_L18_N (bidir), B64_L18_P (bidir), B64_L19_N (bidir), B64_L19_P (bidir), B64_L20_N (bidir), B64_L20_P (bidir), B64_L21_N (bidir), B64_L21_P (bidir), B64_L22_N (bidir), B64_L22_P (bidir), B64_L23_N (bidir), B64_L23_P (bidir), B64_L24_N (bidir), B64_L24_P (bidir), B65_L1_N (bidir), B65_L1_P (bidir), B65_L2_N (bidir), B65_L2_P (bidir), B65_L3_N (bidir), B65_L3_P (bidir), B65_L4_N (bidir), B65_L4_P (bidir), B65_L5_N (bidir), B65_L5_P (bidir), B65_L6_N (bidir), B65_L6_P (bidir), B65_L7_N (bidir), B65_L7_P (bidir), B65_L8_N (bidir), B65_L8_P (bidir), B65_L9_N (bidir), B65_L9_P (bidir), B65_L10_N (bidir), B65_L10_P (bidir), B65_L11_N (bidir), B65_L11_P (bidir), B65_L12_N (bidir), B65_L12_P (bidir), B65_L13_N (bidir), B65_L13_P (bidir), B65_L14_N (bidir), B65_L14_P (bidir), B65_L15_N (bidir), B65_L15_P (bidir), B65_L16_N (bidir), B65_L16_P (bidir), B65_L17_N (bidir), B65_L17_P (bidir), B65_L18_N (bidir), B65_L18_P (bidir), B65_L19_N (bidir), B65_L19_P (bidir), B65_L20_N (bidir), B65_L20_P (bidir), B65_L21_N (bidir), B65_L21_P (bidir), B65_L22_N (bidir), B65_L22_P (bidir), B65_L23_N (bidir), B65_L23_P (bidir), B65_L24_N (bidir), B65_L24_P (bidir), B65_T0 (bidir), B65_T1 (bidir), B65_T2 (bidir), B65_T3 (bidir), PL_ANL_shared_SPI (harness PL_ANL_SPI)

### Harnesses
PL_ANL_SPI: CLK, CS_A1, CS_A2, CS_A3, MOSI

### Nets
GND: J4.9 J4.10 J4.16 J4.21 J4.22 J4.27 J4.28 J4.33 J4.34 J4.39 J4.40 J4.45 J4.46 J4.51 J4.52 J4.57 J4.63 J4.64 J4.70 J4.75 J4.76 J4.81 J4.82 J4.87 J4.93 J4.94 J4.99 J4.100 J4.111 J4.112 J4.117 J4.118 J4.123 J4.124 J4.129 J4.130 J4.135 J4.136 J4.141 J4.142 J4.147 J4.148 J4.153 J4.154
VCCO_64: J4.58 J4.106
VCCO_65: J4.69 J4.105
B64_L1_N: J4.138 ; port B64_L1_N  [project net ANL_02_N1]
B64_L1_P: J4.140 ; port B64_L1_P  [project net ANL_02_P1]
B64_L2_N: J4.132 ; port B64_L2_N  [project net ANL_03_N1]
B64_L2_P: J4.134 ; port B64_L2_P  [project net ANL_03_P1]
B64_L3_N: J4.120 ; port B64_L3_N  [project net ANL_06_N1]
B64_L3_P: J4.122 ; port B64_L3_P  [project net ANL_06_P1]
B64_L4_N: J4.116 ; port B64_L4_N  [project net ANL_07_N1]
B64_L4_P: J4.114 ; port B64_L4_P  [project net ANL_07_P1]
B64_L5_N: J4.104 ; port B64_L5_N
B64_L5_P: J4.102 ; port B64_L5_P
B64_L6_N: J4.96 ; port B64_L6_N  [project net ANL_03_N2]
B64_L6_P: J4.98 ; port B64_L6_P  [project net ANL_03_P2]
B64_L7_N: J4.152 ; port B64_L7_N  [project net ANL_05_N1]
B64_L7_P: J4.150 ; port B64_L7_P  [project net ANL_05_P1]
B64_L8_N: J4.144 ; port B64_L8_N  [project net ANL_01_N1]
B64_L8_P: J4.146 ; port B64_L8_P  [project net ANL_01_P1]
B64_L9_N: J4.108 ; port B64_L9_N  [project net ANL_08_N1]
B64_L9_P: J4.110 ; port B64_L9_P  [project net ANL_08_P1]
B64_L10_N: J4.90 ; port B64_L10_N  [project net ANL_01_N2]
B64_L10_P: J4.92 ; port B64_L10_P  [project net ANL_01_P2]
B64_L11_N: J4.80 ; port B64_L11_N  [project net ANL_00_N2]
B64_L11_P: J4.78 ; port B64_L11_P  [project net ANL_00_P2]
B64_L12_N: J4.126 ; port B64_L12_N  [project net ANL_00_N1]
B64_L12_P: J4.128 ; port B64_L12_P  [project net ANL_00_P1]
B64_L13_N: J4.66 ; port B64_L13_N  [project net ANL_05_N2]
B64_L13_P: J4.68 ; port B64_L13_P  [project net ANL_05_P2]
B64_L14_N: J4.72 ; port B64_L14_N  [project net ANL_09_N2]
B64_L14_P: J4.74 ; port B64_L14_P  [project net ANL_09_P2]
B64_L15_N: J4.38 ; port B64_L15_N  [project net ANL_02_N3]
B64_L15_P: J4.36 ; port B64_L15_P  [project net ANL_02_P3]
B64_L16_N: J4.84 ; port B64_L16_N  [project net ANL_02_N2]
B64_L16_P: J4.86 ; port B64_L16_P  [project net ANL_02_P2]
B64_L17_N: J4.62 ; port B64_L17_N  [project net ANL_06_N2]
B64_L17_P: J4.60 ; port B64_L17_P  [project net ANL_06_P2]
B64_L18_N: J4.56 ; port B64_L18_N  [project net ANL_07_N2]
B64_L18_P: J4.54 ; port B64_L18_P  [project net ANL_07_P2]
B64_L19_N: J4.30 ; port B64_L19_N  [project net ANL_04_N3]
B64_L19_P: J4.32 ; port B64_L19_P  [project net ANL_04_P3]
B64_L20_N: J4.48 ; port B64_L20_N  [project net ANL_04_N2]
B64_L20_P: J4.50 ; port B64_L20_P  [project net ANL_04_P2]
B64_L21_N: J4.44 ; port B64_L21_N  [project net ANL_01_N3]
B64_L21_P: J4.42 ; port B64_L21_P  [project net ANL_01_P3]
B64_L22_N: J4.20 ; port B64_L22_N  [project net ANL_07_N3]
B64_L22_P: J4.18 ; port B64_L22_P  [project net ANL_07_P3]
B64_L23_N: J4.26 ; port B64_L23_N  [project net ANL_06_N3]
B64_L23_P: J4.24 ; port B64_L23_P  [project net ANL_06_P3]
B64_L24_N: J4.12 ; port B64_L24_N
B64_L24_P: J4.14 ; port B64_L24_P
B64_T0: J4.8 ; port PL_ANL_shared_SPI.CLK
B64_T1: J4.6 ; port PL_ANL_shared_SPI.MOSI
B64_T2: J4.2 ; port PL_ANL_shared_SPI.CS_A1
B64_T3: J4.4 ; port PL_ANL_shared_SPI.CS_A2
B65_L1_N: J4.145 ; port B65_L1_N
B65_L1_P: J4.143 ; port B65_L1_P
B65_L2_N: J4.125 ; port B65_L2_N
B65_L2_P: J4.127 ; port B65_L2_P
B65_L3_N: J4.137 ; port B65_L3_N
B65_L3_P: J4.139 ; port B65_L3_P
B65_L4_N: J4.107 ; port B65_L4_N
B65_L4_P: J4.109 ; port B65_L4_P
B65_L5_N: J4.151 ; port B65_L5_N
B65_L5_P: J4.149 ; port B65_L5_P
B65_L6_N: J4.83 ; port B65_L6_N
B65_L6_P: J4.85 ; port B65_L6_P
B65_L7_N: J4.71 ; port B65_L7_N
B65_L7_P: J4.73 ; port B65_L7_P
B65_L8_N: J4.121 ; port B65_L8_N
B65_L8_P: J4.119 ; port B65_L8_P
B65_L9_N: J4.101 ; port B65_L9_N
B65_L9_P: J4.103 ; port B65_L9_P
B65_L10_N: J4.95 ; port B65_L10_N
B65_L10_P: J4.97 ; port B65_L10_P
B65_L11_N: J4.77 ; port B65_L11_N  [project net ANL_09_N3]
B65_L11_P: J4.79 ; port B65_L11_P  [project net ANL_09_P3]
B65_L12_N: J4.65 ; port B65_L12_N  [project net ANL_00_N3]
B65_L12_P: J4.67 ; port B65_L12_P  [project net ANL_00_P3]
B65_L13_N: J4.91 ; port B65_L13_N  [project net ANL_09_N1]
B65_L13_P: J4.89 ; port B65_L13_P  [project net ANL_09_P1]
B65_L14_N: J4.113 ; port B65_L14_N
B65_L14_P: J4.115 ; port B65_L14_P
B65_L15_N: J4.59 ; port B65_L15_N
B65_L15_P: J4.61 ; port B65_L15_P
B65_L16_N: J4.133 ; port B65_L16_N  [project net ANL_04_N1]
B65_L16_P: J4.131 ; port B65_L16_P  [project net ANL_04_P1]
B65_L17_N: J4.17 ; port B65_L17_N  [project net ANL_08_N3]
B65_L17_P: J4.19 ; port B65_L17_P  [project net ANL_08_P3]
B65_L18_N: J4.55 ; port B65_L18_N  [project net ANL_08_N2]
B65_L18_P: J4.53 ; port B65_L18_P  [project net ANL_08_P2]
B65_L19_N: J4.49 ; port B65_L19_N
B65_L19_P: J4.47 ; port B65_L19_P
B65_L20_N: J4.35 ; port B65_L20_N  [project net ANL_03_N3]
B65_L20_P: J4.37 ; port B65_L20_P  [project net ANL_03_P3]
B65_L21_N: J4.31 ; port B65_L21_N  [project net ANL_05_N3]
B65_L21_P: J4.29 ; port B65_L21_P  [project net ANL_05_P3]
B65_L22_N: J4.25 ; port B65_L22_N
B65_L22_P: J4.23 ; port B65_L22_P
B65_L23_N: J4.41 ; port B65_L23_N
B65_L23_P: J4.43 ; port B65_L23_P
B65_L24_N: J4.13 ; port B65_L24_N
B65_L24_P: J4.11 ; port B65_L24_P
B65_T0: J4.7 ; port B65_T0
B65_T1: J4.5 ; port B65_T1
B65_T2: J4.3 ; port B65_T2
B65_T3: J4.1 ; port B65_T3
VREF_65: J4.15 R27.2
NetJ4_88: J4.88 R26.1

Not connected (* = marked no-connect by the designer): J4 155* 156* 157* 158* 159* 160*; R26 2*; R27 1*

### Notes on the sheet
- B64_T2
- B64_T3
- B64_T1
- B64_T0
- GND
- B64_L24_N
- B64_L24_P
- B64_L22_P
- B64_L22_N
- B64_L23_P
- B64_L23_N
- B64_L19_N
- B64_L19_P
- B64_L15_P
- B64_L15_N
- B64_L21_P
- B64_L21_N
- B64_L20_N
- B64_L20_P
- B64_L18_P
- B64_L18_N
- VCCO_64
- B64_L17_P
- B64_L17_N
- B64_L13_N
- B64_L13_P
- B64_L14_N
- B64_L14_P
- B64_L11_P
- B64_L11_N
- (near R26) GND
- (near R26) B64_L16_N
- (near R26) B64_L16_P
- (near R26) VREF_64
- (near R26) B64_L10_N
- (near R26) B64_L10_P
- (near R26) B64_L6_N
- B64_L6_P
- B64_L5_P
- B64_L5_N
- B64_L9_N
- B64_L9_P
- B64_L4_P
- B64_L4_N
- B64_L3_N
- B64_L3_P
- B64_L12_N
- B64_L12_P
- B64_L2_N
- B64_L2_P
- B64_L1_N
- B64_L1_P
- B64_L8_N
- B64_L8_P
- B64_L7_P
- B64_L7_N
- NC
- B65_T3
- B65_T2
- B65_T1
- B65_T0
- (near R27) B65_L24_P
- (near R27) B65_L24_N
- (near R27) VREF_65
- (near R27) B65_L17_N
- (near R27) B65_L17_P
- B65_L22_P
- B65_L22_N
- B65_L21_P
- B65_L21_N
- B65_L20_N
- B65_L20_P
- B65_L23_N
- B65_L23_P
- B65_L19_P
- B65_L19_N
- B65_L18_P
- B65_L18_N
- B65_L15_N
- B65_L15_P
- B65_L12_N
- B65_L12_P
- VCCO_65
- B65_L7_N
- B65_L7_P
- B65_L11_N
- B65_L11_P
- B65_L6_N
- B65_L6_P
- B65_L13_P
- B65_L13_N
- B65_L10_N
- B65_L10_P
- B65_L9_N
- B65_L9_P
- B65_L4_N
- B65_L4_P
- B65_L14_N
- B65_L14_P
- B65_L8_P
- B65_L8_N
- B65_L2_N
- B65_L2_P
- B65_L16_P
- B65_L16_N
- B65_L3_N
- B65_L3_P
- B65_L1_P
- B65_L1_N
- B65_L5_P
- B65_L5_N
- Title
- Revision:
- Design Engineer:
- Date:
- Project:
- Sheet
- of

### Library data of the parts
J4 = SS5-80-3.50-L-D-K-TR: as J2 on sheet J2; Manufacturer Part Number: SS5-80-3.50-L-D-K-TR; PartID: 27; Created On: 01/12/2020 18:14:32; ComponentLink1Description: Homepage; ComponentLink1URL: https://www.samtec.com/de/products/ss5-80-3.50-l-d-k-tr; Component Type: Samtec Connector; Device Package: Connector; Last Updated: 11/07/2024 09:43:54; Mounting Type: SMD; Supplier 1: SAMTEC; Supplier Part Number 1: SS5-80-3.50-L-D-K-TR; Type: Connector; Live Cycle Status: 1; Number of rows: 2; Stock number: not stored; LCSC Part Number: C5292077
R26 R27 = UZgen_R_0603_0R: as R16 on sheet J2; Value: 0R; Manufacturer Part Number: UZgen_R_0603_0R; PartID: 581; Created On: 08.07.2024 14:34:30; Device Package: 0603; Mounting Type: SMD; Last Updated: 08.07.2024 14:34:30

## Sheet isoCAN.SchDoc
size A4; Author: A. Geiger & E. Liegmann; CompanyName: Technische Hochschule Nürnberg Georg Simon Ohm; Organization: UltraZohm; Address1: Kesslerplatz 12; Address2: 90489 Nürnberg; Address3: GERMANY; SheetNumber: 16; SheetTotal: 36; Website: www.ultrazohm.com
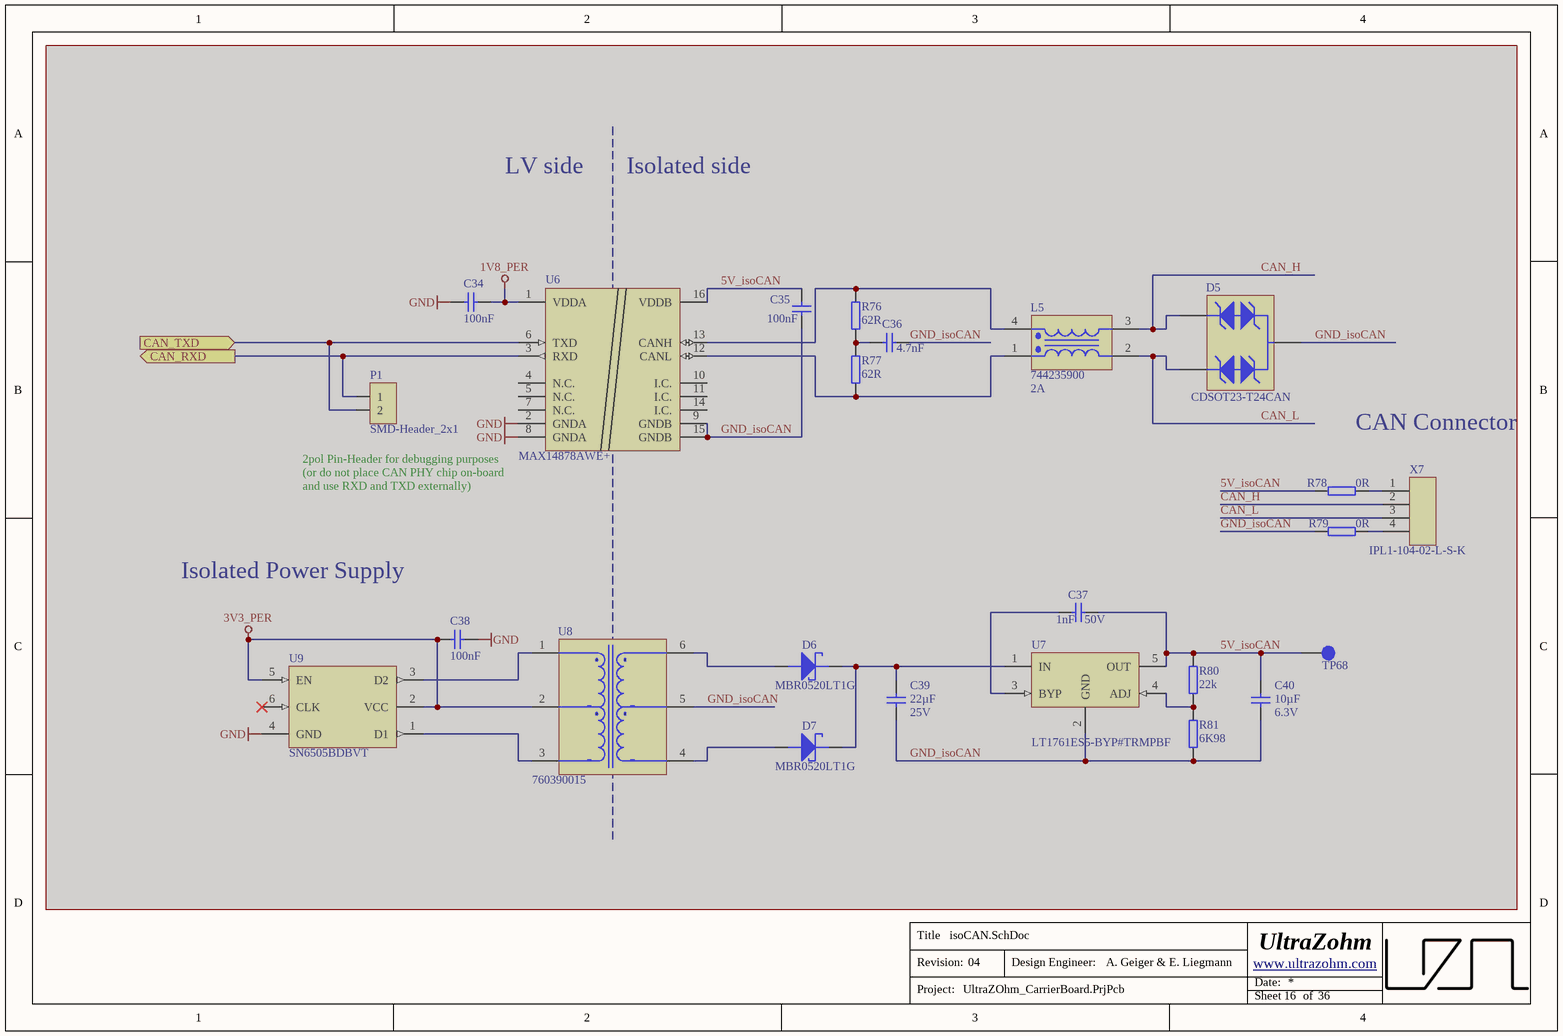
[diagram p16: isoCAN.SchDoc]

### Parts
C34  100nF  [CAPC1608X90N_V]  (masked out: inside a compile mask, not in the netlist)
C35  100nF  [CAPC1608X90N_V]  (masked out: inside a compile mask, not in the netlist)
C36  4.7nF  [CAPC1608X90N_V]  (masked out: inside a compile mask, not in the netlist)
C37  1nF  Voltage: 50V  [CAPC1608X90N_V]  (masked out: inside a compile mask, not in the netlist)
C38  100nF  [CAPC1608X90N_V]  (masked out: inside a compile mask, not in the netlist)
C39  22µF  Voltage: 25V  [CAPC2012X135N_V]  (masked out: inside a compile mask, not in the netlist)
C40  10µF  Voltage: 6.3V  [CAPC1608X90N_V]  (masked out: inside a compile mask, not in the netlist)
D5  CDSOT23-T24CAN  [SOT95P237X112-3N]  (masked out: inside a compile mask, not in the netlist)
D6  MBR0520LT1G  [SOD3816X120N]  (masked out: inside a compile mask, not in the netlist)
D7  MBR0520LT1G  [SOD3816X120N]  (masked out: inside a compile mask, not in the netlist)
L5  744235900  Voltage: 2A  [WE-CNSW-1812]  (masked out: inside a compile mask, not in the netlist)
P1  SMD-Header_2x1  [HDR1X2_SMD]  (masked out: inside a compile mask, not in the netlist)
R76  62R  [RESC1005X40N_V]  (masked out: inside a compile mask, not in the netlist)
R77  62R  [RESC1005X40N_V]  (masked out: inside a compile mask, not in the netlist)
R78  0R  [R_0603_TE]  (masked out: inside a compile mask, not in the netlist)
R79  0R  [R_0603_TE]  (masked out: inside a compile mask, not in the netlist)
R80  22k  [R_0603_TE]  (masked out: inside a compile mask, not in the netlist)
R81  6K98  [RESC1608X55N_V]  (masked out: inside a compile mask, not in the netlist)
TP68  Testpoint 1mm  [TP_1mm]  (value not drawn)  (masked out: inside a compile mask, not in the netlist)
U6  MAX14878AWE+  [SOIC127P1030X265-16N]  (masked out: inside a compile mask, not in the netlist)
U7  LT1761ES5-BYP#TRMPBF  [SOT23-5_N]  (masked out: inside a compile mask, not in the netlist)
U8  760390015  [760390015]  (masked out: inside a compile mask, not in the netlist)
U9  SN6505BDBVT  [SOT95P280X145-6N]  (masked out: inside a compile mask, not in the netlist)
X7  IPL1-104-02-L-S-K  [IPL1-104-02-L-S-K]  (masked out: inside a compile mask, not in the netlist)

### Ports
CAN_RXD (out), CAN_TXD (in)

### Notes on the sheet
- LV side
- Isolated side
- CAN Connector
- 2pol Pin-Header for debugging purposes
  (or do not place CAN PHY chip on-board and use RXD and TXD externally)
- Isolated Power Supply
- Title
- Revision:
- Design Engineer:
- Date:
- Project:
- Sheet
- of

### Library data of the parts
C34 C35 C38 = 21382: KON 100nF 50V X7R ±10% SMD BF 1608 (0603); Value: 100n; AN: 21382; Mixed: SMT; Preferred: Yes; Temperature-Range: -55/+125; Tolerance: ±10%; Voltage: 50V; Technology: X7R; Case: 1608 (0603)
C36 = 29638: KON 4.7nF 50V NP0 ±5%  SMD BF 1608 (0603); Value: 4.7n; AN: 29638; Mixed: SMT; Tolerance: ±5%; Voltage: 50V; Technology: NP0; Case: 1608 (0603)
C37 = 22523: KON 1nF 50V NP0 5% SMD BF 1608 (0603); Value: 1n; AN: 22523; Mixed: SMT; Technology: NP0; Case: 1608 (0603)
C39 = 29556: KON 22µF 25V  X5R 20% SMD BF 2012 (0805); Value: 22u; AN: 29556; Mixed: SMT; Temperature-Range: -55/+85; Technology: X5R; Case: 2012 (0805); Tolerance: 20%
C40 = 22918: KON 10µF 6,3V X5R SMD BF 1608 (0603); Value: 10u; AN: 22918; Mixed: SMT; Temperature-Range: -55/+85; Technology: X5R; Case: 1608 (0603)
D5 = 27400: TVS Diode 24/40V SOT23-3; AN: 27400; Mixed: SMT; Extra: ESD Protection of 2 lines, CAN bus, Bidirectional; Case: SOT23-3; HelpURL: b:\AD\adlib\datasheet\CDSOT23-T24CAN; H-ART: CDSOT23-T24CAN
D6 D7 = 26768: Schottky Diode 0.5A 20V SOD-123; AN: 26768; Mixed: SMT; Extra: AEC−Q101; Value: 20V; Case: SOD123-FC; Voltage: 0.5A; HelpURL: B:\AD\adlib\datasheet\MBR0520; H-ART: MBR0520LT1G
L5 = 30776: Common Mode Choke SMT 0.3uH 2A 50mOhms; AN: 30776; Tolerance: 20%; Value: 0.3u; Temperature-Range: -40/+85; Case: WE-CNSW-1812; Technology: 50mOhm; Mixed: SMT; HelpURL: b:\AD\adlib\datasheet\Wuerth\WE-CNSW\744235900\; H-ART: 744235900; Extra: 744235900
P1 = Pinheader_2x1_SMD: SMD-Header, 2-Pin; Created: 2018_12_05_AGeiger; Value: SMD-Header_2x1
R76 R77 = 23134: WID SMD 62R 1% 0,063W; Value: 62; AN: 23134; Mixed: SMT; Preferred: Yes; Extra: BF 1005 (0402); Tolerance: 1%; Case: 1005 (0402); Technology: TK100
R78 R79 = UZgen_R_0603_0R: as R16 on sheet J2; Value: 0R; Manufacturer Part Number: UZgen_R_0603_0R; PartID: 581; Created On: 08.07.2024 14:34:30; Device Package: 0603; Mounting Type: SMD; Last Updated: 08.07.2024 14:34:30
R80 = UZgen_R_0603_22k: Generic resistor; Manufacturer: UZgen; Tolerance: 1 %; Created from: UZgenTool; Value: 22k; Manufacturer Part Number: UZgen_R_0603_22k; PartID: 252; Created On: 02.07.2024 17:29:50; Device Package: 0603; Mounting Type: SMD; Last Updated: 02.07.2024 17:29:50
R81 = 26473: WID SMD 6K98 1% 0,1W  BF 1608 (0603); AN: 26473; Mixed: SMT; Value: 6.98k; Preferred: Yes; Tolerance: 1%; Case: 1608 (0603); Technology: TK100
TP68 = 25063: AN: 25063; Mixed: SMT
U6 = 30766: AN: 30766; Mixed: SMT; Trenz-Stock: Yes; Temperature-Range: -40/+125; Extra: 5kV Isolated CAN Transceiver SOIC-16; Case: SOIC16; HelpURL: b:\AD\adlib\datasheet\Maxim\MAX14878\; H-ART: MAX14878AWE+; Storage-Temperature: -60/+150(Abs)
U7 = LT1761ES5-BYP#TRMPBF: 100mA, Low Noise, LDO Micropower Regulators; belongs to SN74AVC4T774RSVR; Manufacturer: Linear Technology; Created from: MGremer; Manufacturer Part Number: LT1761ES5-BYP#TRMPBF; PartID: 5; Created On: 30.11.2020 13:55:34; ComponentLink1Description: Datasheet; ComponentLink1URL: https://www.analog.com/media/en/technical-documentation/data-sheets/1761sff.pdf; Component Type: LDO Micropower; Device Package: TSOT-23; Last Updated: 15.02.2021 10:27:30; Mounting Type: SMD; Supplier 1: Farnell; Supplier Part Number 1: 1663782; Type: LDO Micropower Regulator; Live Cycle Status: 1; Stock number: not stored
U8 = 30767: AN: 30767; Mixed: SMT; Temperature-Range: -40/+125; Extra: Push-Pull Transformer 1:2 0.35A; Case: MID-PPTI; HelpURL: b:\AD\adlib\datasheet\Wuerth\MID-PPTI\760390015\; H-ART: 760390015
U9 = 30768: AN: 30768; Mixed: SMT; Temperature-Range: -55/+125; Extra: 1-A Transformer Driver for Isolated Power Supplies SOT23-6; Case: SOT23-6; HelpURL: b:\AD\adlib\datasheet\TI\SN6505x\; H-ART: SN6505BDBVT; Storage-Temperature: -65/+150 (Abs)
X7 = 30790: AN: 30790; Mixed: SMT; H-ART: IPL1-104-02-L-S-K-TR; Temperature-Range: -55/+125; Extra: Connector Header IPL1, 1-row 4pos, key polarization, SMT 0°; Case: IPL1; HelpURL: b:\AD\adlib\datasheet\Samtec\IPL1-SMT\

## Sheet isoSPI.SchDoc
size A4; Author: A. Geiger & E. Liegmann; CompanyName: Technische Hochschule Nürnberg Georg Simon Ohm; Organization: UltraZohm; Address1: Kesslerplatz 12; Address2: 90489 Nürnberg; Address3: GERMANY; SheetNumber: 17; SheetTotal: 36; Website: www.ultrazohm.com
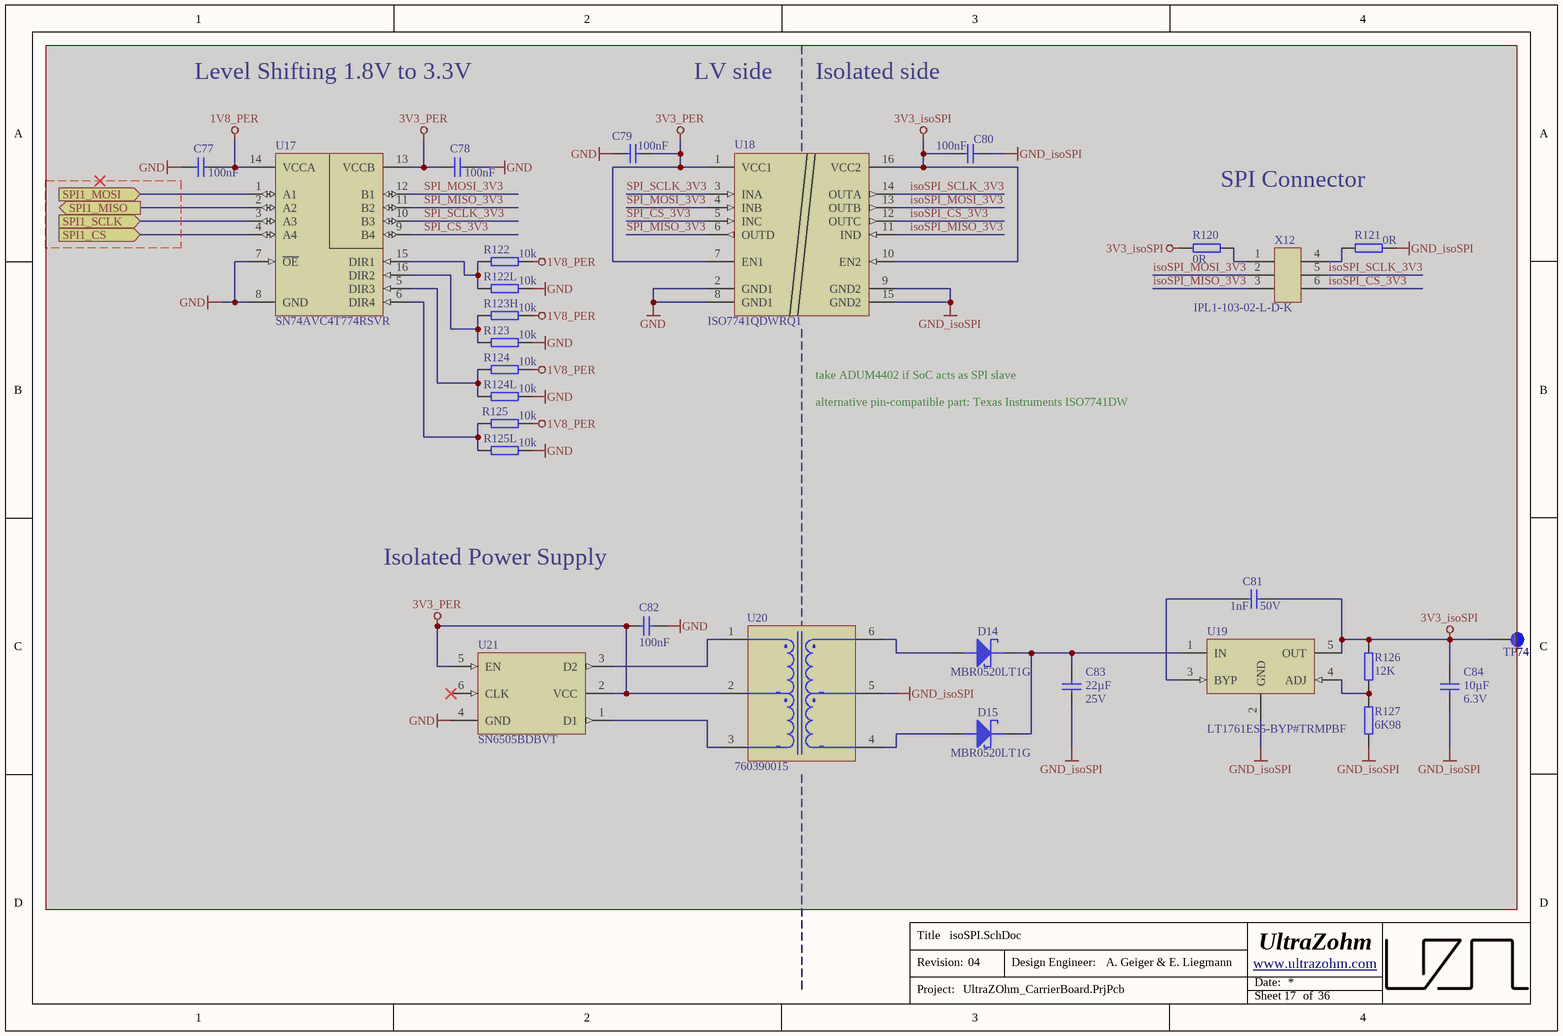
[diagram p17: isoSPI.SchDoc]

### Parts
(Parts that share a designator on the sheet are numbered #1, #2 ... from top to bottom, then left to right.)
C77  100nF  [CAPC1608X90N_V]  (masked out: inside a compile mask, not in the netlist)
C78  100nF  [CAPC1608X90N_V]  (masked out: inside a compile mask, not in the netlist)
C79  100nF  [CAPC1608X90N_V]  (masked out: inside a compile mask, not in the netlist)
C80  100nF  [CAPC1608X90N_V]  (masked out: inside a compile mask, not in the netlist)
C81  1nF  Voltage: 50V  [CAPC1608X90N_V]  (masked out: inside a compile mask, not in the netlist)
C82  100nF  [CAPC1608X90N_V]  (masked out: inside a compile mask, not in the netlist)
C83  22µF  Voltage: 25V  [CAPC2012X135N_V]  (masked out: inside a compile mask, not in the netlist)
C84  10µF  Voltage: 6.3V  [CAPC1608X90N_V]  (masked out: inside a compile mask, not in the netlist)
D14  MBR0520LT1G  [SOD3816X120N]  (masked out: inside a compile mask, not in the netlist)
D15#1  MBR0520LT1G  [SOD3816X120N]  (masked out: inside a compile mask, not in the netlist)
R120  0R  [R_0603_TE]  (masked out: inside a compile mask, not in the netlist)
R121#1  0R  [R_0603_TE]  (masked out: inside a compile mask, not in the netlist)
R122#1  10k  [R_0603_TE]  (masked out: inside a compile mask, not in the netlist)
R122L  10k  [R_0603_TE]  (masked out: inside a compile mask, not in the netlist)
R123#1  10k  [R_0603_TE]  (masked out: inside a compile mask, not in the netlist)
R123H  10k  [R_0603_TE]  (masked out: inside a compile mask, not in the netlist)
R124  10k  [R_0603_TE]  (masked out: inside a compile mask, not in the netlist)
R124L  10k  [R_0603_TE]  (masked out: inside a compile mask, not in the netlist)
R125  10k  [R_0603_TE]  (masked out: inside a compile mask, not in the netlist)
R125L  10k  [R_0603_TE]  (masked out: inside a compile mask, not in the netlist)
R126  12K  [RESC1608X55N_V]  (masked out: inside a compile mask, not in the netlist)
R127  6K98  [RESC1608X55N_V]  (masked out: inside a compile mask, not in the netlist)
TP74  Testpoint 1mm  [TP_1mm]  (value not drawn)  (masked out: inside a compile mask, not in the netlist)
U17  SN74AVC4T774RSVR  [QFN40P260X180X55-16N]  (masked out: inside a compile mask, not in the netlist)
U18  ISO7741QDWRQ1  [SOIC127P1030X265-16N]  (masked out: inside a compile mask, not in the netlist)
U19  LT1761ES5-BYP#TRMPBF  [SOT23-5_N]  (masked out: inside a compile mask, not in the netlist)
U20  760390015  [760390015]  (masked out: inside a compile mask, not in the netlist)
U21  SN6505BDBVT  [SOT95P280X145-6N]  (masked out: inside a compile mask, not in the netlist)
X12  IPL1-103-02-L-D-K  [IPL1-103-02-L-D-K]  (masked out: inside a compile mask, not in the netlist)

### Ports
SPI1_CS (in), SPI1_MISO (out), SPI1_MOSI (in), SPI1_SCLK (in)

### Notes on the sheet
- Level Shifting 1.8V to 3.3V
- LV side
- Isolated side
- SPI Connector
- take ADUM4402 if SoC acts as SPI slave
- alternative pin-compatible part: Texas Instruments ISO7741DW
- Isolated Power Supply
- Title
- Revision:
- Design Engineer:
- Date:
- Project:
- Sheet
- of

### Library data of the parts
C77-C80 C82 = 21382: as C34 on sheet isoCAN; Tolerance: ±10%; Voltage: 50V; Technology: X7R; Case: 1608 (0603)
C81 = 22523: as C37 on sheet isoCAN; Technology: NP0; Case: 1608 (0603)
C83 = 29556: as C39 on sheet isoCAN; Technology: X5R; Case: 2012 (0805); Tolerance: 20%
C84 = 22918: as C40 on sheet isoCAN; Technology: X5R; Case: 1608 (0603)
D14 D15#1 = 26768: as D6 on sheet isoCAN; Value: 20V; Case: SOD123-FC; Voltage: 0.5A; HelpURL: B:\AD\adlib\datasheet\MBR0520; H-ART: MBR0520LT1G
R120 R121#1 = UZgen_R_0603_0R: as R16 on sheet J2; Value: 0R; Manufacturer Part Number: UZgen_R_0603_0R; PartID: 581; Created On: 08.07.2024 14:34:30; Device Package: 0603; Mounting Type: SMD; Last Updated: 08.07.2024 14:34:30
R122#1 R122L R123#1 R123H R124 R124L R125 R125L = UZgen_R_0603_10k: as R3 on sheet J2; Value: 10k; Manufacturer Part Number: UZgen_R_0603_10k; PartID: 1; Created On: 02.07.2024 14:34:53; Device Package: 0603; Mounting Type: SMD; Last Updated: 02.07.2024 14:37:16
R126 = 22655: WID SMD 12K 1% 0,1W; AN: 22655; Mixed: SMT; Extra: BF 1608 (0603); Tolerance: 1%; Case: 1608 (0603); Technology: TK100; Value: 12K
R127 = 26473: as R81 on sheet isoCAN; Tolerance: 1%; Case: 1608 (0603); Technology: TK100
TP74 = 25063: AN: 25063; Mixed: SMT
U17 = 27170: AN: 27170; Mixed: SMT; Trenz-Stock: Yes; Extra: 4-Bit Dual-Supply Bus Transceiver With Configurable Voltage Translationand 3-Sta; HelpURL: B:\ad\adlib\datasheet\sn74avc4t774; Case: UQFN-16; H-ART: SN74AVC4T774RSVR
U18 = 30781: AN: 30781; Mixed: SMT; Temperature-Range: -40/+125; Extra: General Purpose Digital Isolator 5000Vrms 4 Channel 100Mbps 3/1 16-SOIC; Case: SOIC16; HelpURL: b:\AD\adlib\datasheet\TI\ISO774x\; H-ART: ISO7741QDWRQ1; Storage-Temperature: -65/+150(Abs)
U19 = LT1761ES5-BYP#TRMPBF: as U7 on sheet isoCAN; Manufacturer Part Number: LT1761ES5-BYP#TRMPBF; PartID: 5; Created On: 30.11.2020 13:55:34; ComponentLink1Description: Datasheet; ComponentLink1URL: https://www.analog.com/media/en/technical-documentation/data-sheets/1761sff.pdf; Component Type: LDO Micropower; Device Package: TSOT-23; Last Updated: 15.02.2021 10:27:30; Mounting Type: SMD; Supplier 1: Farnell; Supplier Part Number 1: 1663782; Type: LDO Micropower Regulator; Live Cycle Status: 1; Stock number: not stored
U20 = 30767: as U8 on sheet isoCAN; Case: MID-PPTI; HelpURL: b:\AD\adlib\datasheet\Wuerth\MID-PPTI\760390015\; H-ART: 760390015
U21 = 30768: as U9 on sheet isoCAN; Case: SOT23-6; HelpURL: b:\AD\adlib\datasheet\TI\SN6505x\; H-ART: SN6505BDBVT; Storage-Temperature: -65/+150 (Abs)
X12 = 30760: AN: 30760; Mixed: SMT; H-ART: IPL1-103-02-L-D-K-TR; Temperature-Range: -55/+125; Extra: Connector Header IPL1, 2-row 6pos, key polarization, SMT 0°; Case: IPL1; HelpURL: b:\AD\adlib\datasheet\Samtec\IPL1-SMT\